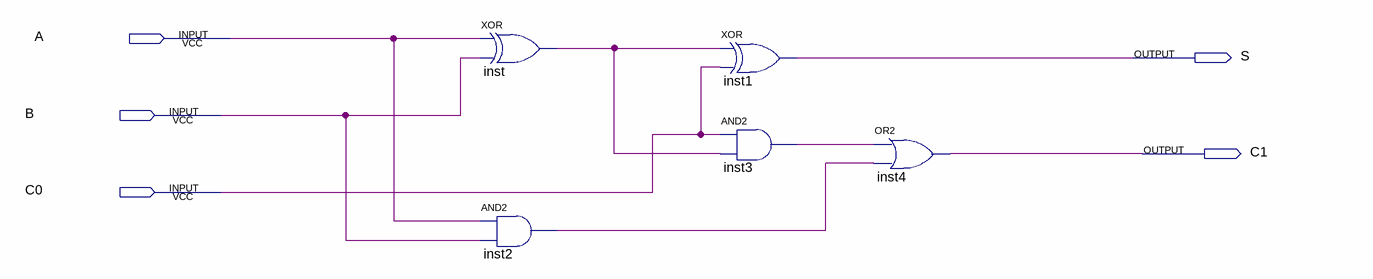
[diagram p0: schematic sheet]
// Quartus schematic add.bdf as structural Verilog: 5 symbols, 5 pins
module add (
  input  A,
  input  B,
  input  C0,
  output S,
  output C1
);

  wire inst2_out, inst3_out, inst_out;

  xor inst (inst_out, A, B);
  and inst2 (inst2_out, A, B);
  xor inst1 (S, inst_out, C0);
  and inst3 (inst3_out, C0, inst_out);
  or inst4 (C1, inst3_out, inst2_out);
endmodule
